# EAGLE design M5stack_proto2 (EAGLE 9.0.0)
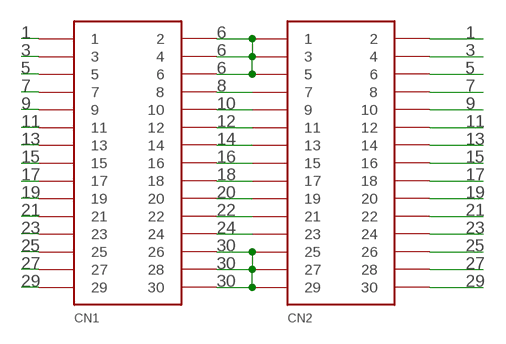
[diagram p0: schematic, sheet 1]

## Parts
CN1  CON_PINHD-2X15  [2X15SMD]
CN2  CON_PINHD-2X15  [2X15SMD]

## Nets
1: CN1.P$1 CN2.P$2
3: CN1.P$3 CN2.P$4
5: CN1.P$5 CN2.P$6
6: CN1.P$2 CN1.P$4 CN1.P$6 CN2.P$1 CN2.P$3 CN2.P$5
7: CN1.P$7 CN2.P$8
8: CN1.P$8 CN2.P$7
9: CN1.P$9 CN2.P$10
10: CN1.P$10 CN2.P$9
11: CN1.P$11 CN2.P$12
12: CN1.P$12 CN2.P$11
13: CN1.P$13 CN2.P$14
14: CN1.P$14 CN2.P$13
15: CN1.P$15 CN2.P$16
16: CN1.P$16 CN2.P$15
17: CN1.P$17 CN2.P$18
18: CN1.P$18 CN2.P$17
19: CN1.P$19 CN2.P$20
20: CN1.P$20 CN2.P$19
21: CN1.P$21 CN2.P$22
22: CN1.P$22 CN2.P$21
23: CN1.P$23 CN2.P$24
24: CN1.P$24 CN2.P$23
25: CN1.P$25 CN2.P$26
27: CN1.P$27 CN2.P$28
29: CN1.P$29 CN2.P$30
30: CN1.P$26 CN1.P$28 CN1.P$30 CN2.P$25 CN2.P$27 CN2.P$29

## Library data of the parts
CN1 CN2 = akita:CON_PINHD-2X15

## Board
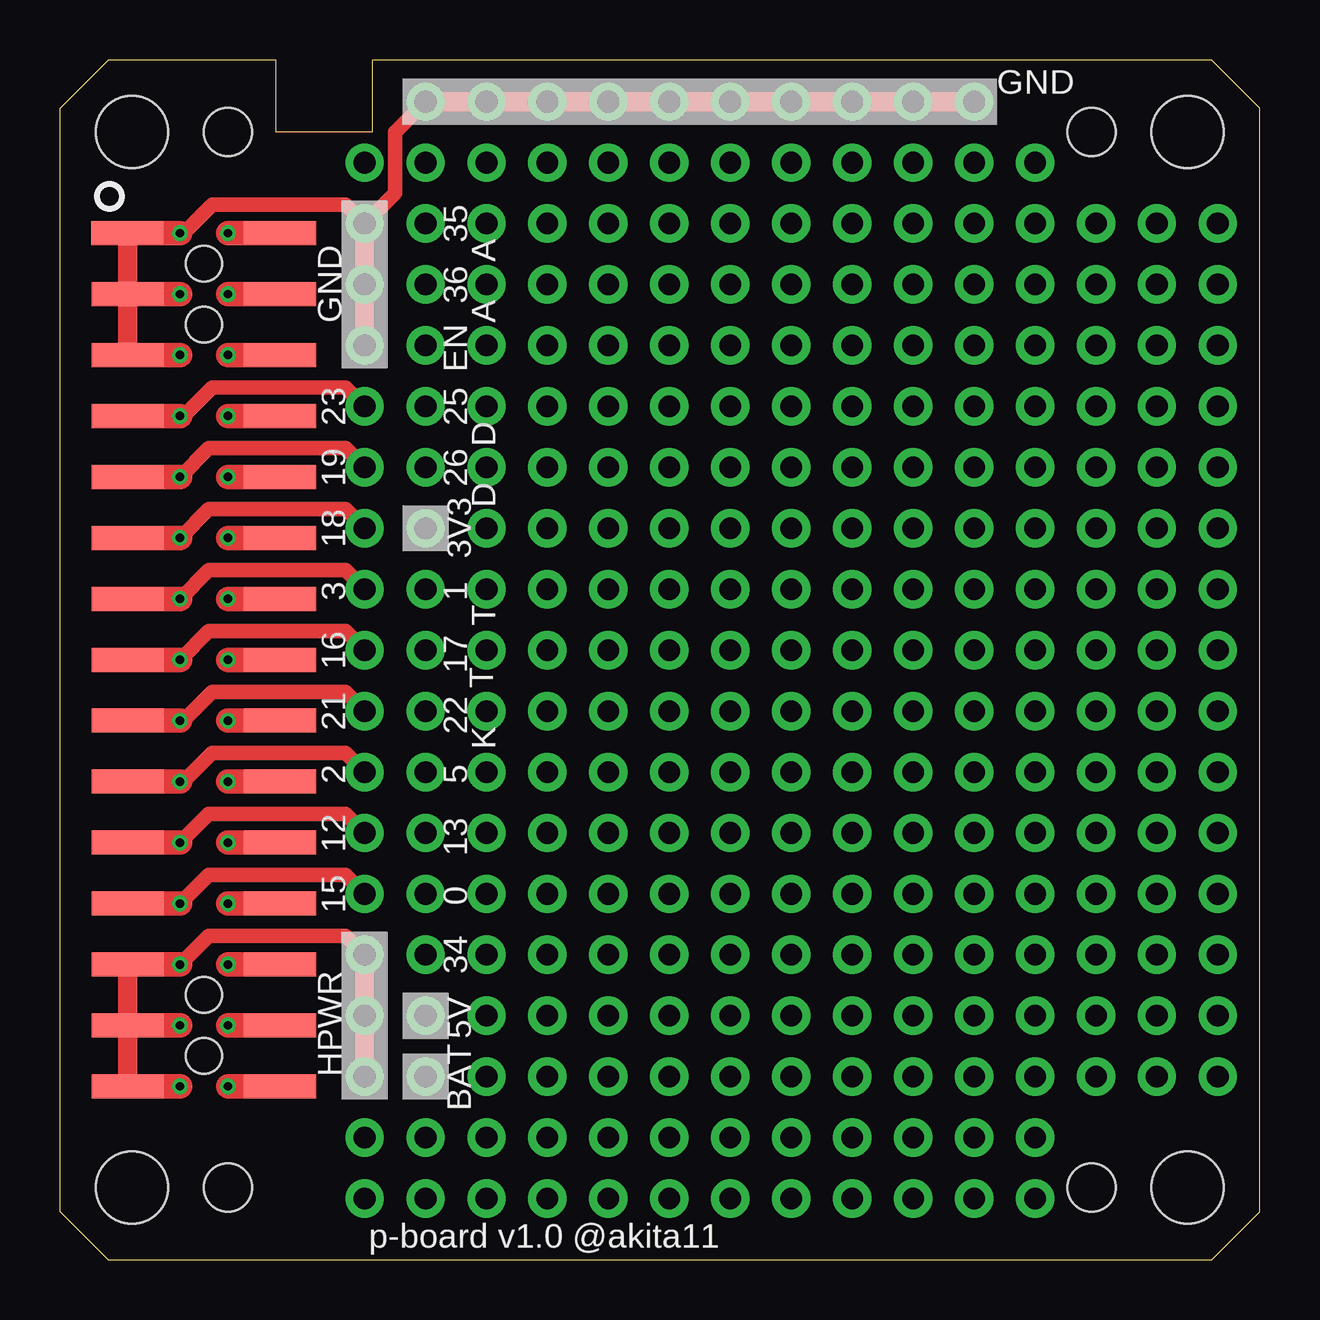
[diagram p1: board, top side]
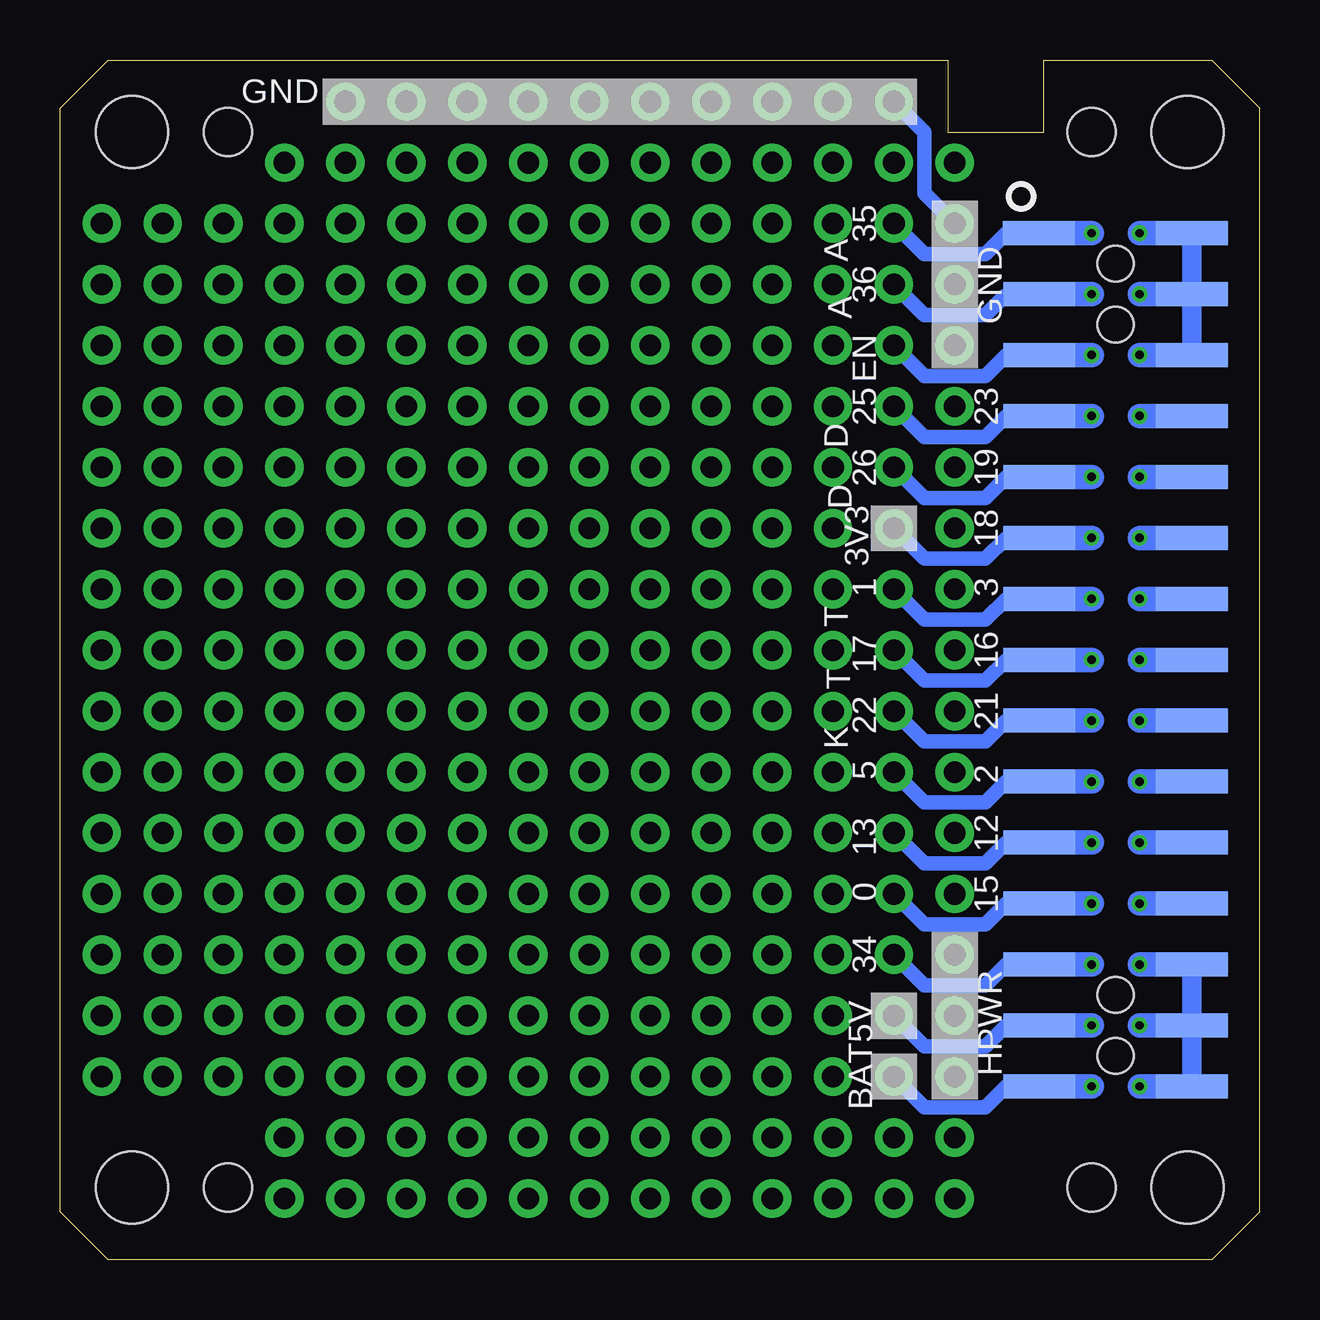
[diagram p2: board, bottom side, seen from below]

Size 50 x 50 mm. Coordinates in mm from the lower left corner, seen from the top.
Outline: 0,2 2,0 48,0 50,2 50,48 48,50 13,50 13,47 9,47 9,50 2,50 0,48 0,2
Copper layers (1*16): Top 0.035mm / dielectric 1.5mm / Bottom 0.035mm
Design rules "SeeedStudio_2layer_DRU_no_angle_20140221": minimum track width 6mil, minimum drill 12mil, track to track 6mil, track to pad 6mil, pad to pad 6mil, via to via 6mil, smd to smd 0mil, copper to edge 10mil, drill to drill 10mil, minimum pad ring 10mil, minimum via ring 6mil, stop-mask expansion 2mil, vias tented up to drill 100mil, thermal gap 10mil
Holes 3 mm at 3,3 3,47 47,47 47,3
Holes 2 mm at 7,3 7,47 43,47 43,3
Holes 1.5 mm at 6,41.51 6,38.97 6,8.49 6,11.03

### Footprints (pad centres in the part's own frame; a part is rotated, then mirrored left to right if it is on the bottom)
2X15SMD = smd 3 x 1: P$1 -3.2,17.78; P$2 3.175,17.78; P$3 -3.175,15.24; P$4 3.175,15.24; P$5 -3.175,12.7; P$6 3.175,12.7; P$7 -3.175,10.16; P$8 3.175,10.16; P$9 -3.175,7.62; P$10 3.175,7.62; P$11 -3.175,5.08; P$12 3.175,5.08; P$13 -3.175,2.54; P$14 3.175,2.54; P$15 -3.175,0; P$16 3.175,0; P$17 -3.175,-2.54; P$18 3.175,-2.54; P$19 -3.175,-5.08; P$20 3.175,-5.08; P$21 -3.175,-7.62; P$22 3.175,-7.62; P$23 -3.175,-10.16; P$24 3.175,-10.16; P$25 -3.175,-12.7; P$26 3.175,-12.7; P$27 -3.175,-15.24; P$28 3.175,-15.24; P$29 -3.175,-17.78; P$30 3.175,-17.78

### Placement (x,y rotation side)
CN1  6,25 0 bottom
CN2  6,25 0 top

### Tracks (layer width: path | path; a pad name or v marks a point on that pad's centre or on a via)
1  (via drill 0.35, 0.9 pad 1.6)
  Top 1.016: v7,42.78 CN2.P$2
  Bottom 0.61: CN1.P$1 10.56,42.78 11.43,41.91 13.97,41.91 v15.24,43.18
  Bottom 1.016: CN1.P$1 v7,42.78
3  (via drill 0.35, 0.9 pad 1.6)
  Top 1.016: CN2.P$4 v7,40.24
  Bottom 0.61: CN2.P$4 9.25,40.16 10.64,40.16 11.43,39.37 13.97,39.37 v15.24,40.64
  Bottom 1.016: v7,40.24 CN2.P$4
5  (via drill 0.35, 0.9 pad 1.6)
  Top 1.016: v7,37.7 CN2.P$6
  Bottom 0.61: v15.24,38.1 13.97,36.83 11.43,36.83 10.56,37.7 CN2.P$6
  Bottom 1.016: CN2.P$6 v7,37.7
6  (via drill 0.35, 0.9 pad 1.6)
  Top 0.61: v5,42.78 5.16,42.78 6.35,43.97 11.91,43.97 v12.7,43.18 13.97,44.45 13.97,46.99 v15.24,48.26
  Top 0.813: CN2.P$5 CN2.P$3 2.83,42.76 CN2.P$1 | v12.7,43.18 v12.7,40.64 v12.7,38.1 | v15.24,48.26 v17.78,48.26 v20.32,48.26 v22.86,48.26 v25.4,48.26 v27.94,48.26 v30.48,48.26 v33.02,48.26 v35.56,48.26 v38.1,48.26
  Top 1.016: CN2.P$5 v5,37.7 | CN2.P$1 v5,42.78 | v5,40.24 CN2.P$3
  Bottom 0.61: v12.7,43.18 13.97,44.45 13.97,46.99 v15.24,48.26
  Bottom 0.813: CN1.P$2 CN2.P$3 CN2.P$5
  Bottom 1.016: v5,37.7 CN2.P$5 | v5,42.78 CN1.P$2 | CN2.P$3 v5,40.24
7  (via drill 0.35, 0.9 pad 1.6)
  Top 1.016: CN2.P$8 v7,35.16
  Bottom 0.61: v15.24,35.56 13.97,34.29 11.43,34.29 10.56,35.16 CN2.P$8
  Bottom 1.016: v7,35.16 CN2.P$8
8  (via drill 0.35, 0.9 pad 1.6)
  Top 0.61: v5,35.16 5.16,35.16 6.35,36.35 11.91,36.35 v12.7,35.56
  Top 1.016: v5,35.16 CN2.P$7
  Bottom 1.016: CN2.P$7 v5,35.16
9  (via drill 0.35, 0.9 pad 1.6)
  Top 1.016: CN2.P$10 v7,32.62
  Bottom 0.61: v15.24,33.02 13.97,31.75 11.43,31.75 10.56,32.62 CN2.P$10
  Bottom 1.016: CN2.P$10 v7,32.62
10  (via drill 0.35, 0.9 pad 1.6)
  Top 0.61: v5,32.62 6.19,33.81 11.91,33.81 v12.7,33.02
  Top 1.016: CN2.P$9 v5,32.62
  Bottom 1.016: v5,32.62 CN2.P$9
11  (via drill 0.35, 0.9 pad 1.6)
  Top 1.016: CN2.P$12 v7,30.08
  Bottom 0.61: v15.24,30.48 13.97,29.21 11.43,29.21 10.56,30.08 CN2.P$12
  Bottom 1.016: v7,30.08 CN2.P$12
12  (via drill 0.35, 0.9 pad 1.6)
  Top 0.61: v5,30.08 6.19,31.27 11.91,31.27 v12.7,30.48
  Top 1.016: v5,30.08 CN2.P$11
  Bottom 1.016: CN2.P$11 v5,30.08
13  (via drill 0.35, 0.9 pad 1.6)
  Top 1.016: v7,27.54 CN2.P$14
  Bottom 0.61: v15.24,27.94 13.97,26.67 11.43,26.67 10.56,27.54 CN2.P$14
  Bottom 1.016: CN2.P$14 v7,27.54
14  (via drill 0.35, 0.9 pad 1.6)
  Top 0.61: v5,27.54 6.19,28.73 11.91,28.73 v12.7,27.94
  Top 1.016: CN2.P$13 v5,27.54
  Bottom 1.016: v5,27.54 CN2.P$13
15  (via drill 0.35, 0.9 pad 1.6)
  Top 1.016: CN2.P$16 v7,25
  Bottom 0.61: v15.24,25.4 13.97,24.13 11.43,24.13 10.56,25 CN2.P$16
  Bottom 1.016: v7,25 CN2.P$16
16  (via drill 0.35, 0.9 pad 1.6)
  Top 0.61: v5,25 6.19,26.19 10.16,26.19 10.95,26.19 11.91,26.19 v12.7,25.4
  Top 1.016: v5,25 CN2.P$15
  Bottom 1.016: CN2.P$15 v5,25
17  (via drill 0.35, 0.9 pad 1.6)
  Top 1.016: v7,22.46 CN2.P$18
  Bottom 0.61: v15.24,22.86 13.97,21.59 11.43,21.59 10.56,22.46 8.89,22.46
  Bottom 1.016: CN2.P$18 8.89,22.46 v7,22.46
18  (via drill 0.35, 0.9 pad 1.6)
  Top 0.61: v5,22.46 5.16,22.46 6.35,23.65 11.91,23.65 v12.7,22.86
  Top 1.016: CN2.P$17 v5,22.46
  Bottom 1.016: v5,22.46 CN2.P$17
19  (via drill 0.35, 0.9 pad 1.6)
  Top 1.016: CN2.P$20 v7,19.92
  Bottom 0.61: v15.24,20.32 13.97,19.05 11.43,19.05 10.56,19.92 CN2.P$20
  Bottom 1.016: v7,19.92 CN2.P$20
20  (via drill 0.35, 0.9 pad 1.6)
  Top 0.61: v5,19.92 5.16,19.92 6.35,21.11 11.91,21.11 v12.7,20.32
  Top 1.016: v5,19.92 CN2.P$19
  Bottom 1.016: CN2.P$19 v5,19.92
21  (via drill 0.35, 0.9 pad 1.6)
  Top 1.016: v7,17.38 CN2.P$22
  Bottom 0.61: v15.24,17.78 13.97,16.51 11.43,16.51 10.56,17.38 CN2.P$22
  Bottom 1.016: CN2.P$22 v7,17.38
22  (via drill 0.35, 0.9 pad 1.6)
  Top 0.61: v5,17.38 6.19,18.57 11.91,18.57 v12.7,17.78
  Top 1.016: CN2.P$21 v5,17.38
  Bottom 1.016: v5,17.38 CN2.P$21
23  (via drill 0.35, 0.9 pad 1.6)
  Top 1.016: CN2.P$24 v7,14.84
  Bottom 0.61: v15.24,15.24 13.97,13.97 11.43,13.97 10.56,14.84 CN2.P$24
  Bottom 1.016: v7,14.84 CN2.P$24
24  (via drill 0.35, 0.9 pad 1.6)
  Top 0.61: v5,14.84 6.19,16.03 11.91,16.03 v12.7,15.24
  Top 1.016: v5,14.84 CN2.P$23
  Bottom 1.016: CN2.P$23 v5,14.84
25  (via drill 0.35, 0.9 pad 1.6)
  Top 1.016: v7,12.3 CN2.P$26
  Bottom 0.61: v15.24,12.7 13.97,11.43 11.43,11.43 10.56,12.3 CN2.P$26
  Bottom 1.016: CN2.P$26 v7,12.3
27  (via drill 0.35, 0.9 pad 1.6)
  Top 1.016: CN2.P$28 v7,9.76
  Bottom 0.61: v15.24,10.16 13.97,8.89 11.43,8.89 10.56,9.76 CN2.P$28
  Bottom 1.016: v7,9.76 CN2.P$28
29  (via drill 0.35, 0.9 pad 1.6)
  Top 1.016: v7,7.22 CN2.P$30
  Bottom 0.61: v15.24,7.62 13.97,6.35 11.43,6.35 10.56,7.22 CN2.P$30
  Bottom 1.016: CN2.P$30 v7,7.22
30  (via drill 0.35, 0.9 pad 1.6)
  Top 0.61: v5,12.3 6.19,13.49 11.91,13.49 v12.7,12.7
  Top 0.813: CN2.P$25 CN2.P$27 CN2.P$29 | v12.7,12.7 v12.7,10.16 v12.7,7.62
  Top 1.016: CN2.P$29 v5,7.22 | CN2.P$25 v5,12.3 | v5,9.76 CN2.P$27
  Bottom 0.813: CN2.P$29 CN2.P$27 CN2.P$25
  Bottom 1.016: v5,7.22 CN2.P$29 | v5,12.3 CN2.P$25 | CN2.P$27 v5,9.76
N$2  (via drill 0.9 pad 1.6)
  other vias: 12.7,45.72
N$18  (via drill 0.9 pad 1.6)
  other vias: 12.7,5.08
N$19  (via drill 0.9 pad 1.6)
  other vias: 12.7,2.54
N$21  (via drill 0.9 pad 1.6)
  other vias: 15.24,45.72
N$37  (via drill 0.9 pad 1.6)
  other vias: 15.24,5.08
N$38  (via drill 0.9 pad 1.6)
  other vias: 15.24,2.54
N$40  (via drill 0.9 pad 1.6)
  other vias: 17.78,45.72
N$41  (via drill 0.9 pad 1.6)
  other vias: 17.78,43.18
N$42  (via drill 0.9 pad 1.6)
  other vias: 17.78,40.64
N$43  (via drill 0.9 pad 1.6)
  other vias: 17.78,38.1
N$44  (via drill 0.9 pad 1.6)
  other vias: 17.78,35.56
N$45  (via drill 0.9 pad 1.6)
  other vias: 17.78,33.02
N$46  (via drill 0.9 pad 1.6)
  other vias: 17.78,30.48
N$47  (via drill 0.9 pad 1.6)
  other vias: 17.78,27.94
N$48  (via drill 0.9 pad 1.6)
  other vias: 17.78,25.4
N$49  (via drill 0.9 pad 1.6)
  other vias: 17.78,22.86
N$50  (via drill 0.9 pad 1.6)
  other vias: 17.78,20.32
N$51  (via drill 0.9 pad 1.6)
  other vias: 17.78,17.78
N$52  (via drill 0.9 pad 1.6)
  other vias: 17.78,15.24
N$53  (via drill 0.9 pad 1.6)
  other vias: 17.78,12.7
N$54  (via drill 0.9 pad 1.6)
  other vias: 17.78,10.16
N$55  (via drill 0.9 pad 1.6)
  other vias: 17.78,7.62
N$56  (via drill 0.9 pad 1.6)
  other vias: 17.78,5.08
N$57  (via drill 0.9 pad 1.6)
  other vias: 17.78,2.54
N$59  (via drill 0.9 pad 1.6)
  other vias: 20.32,45.72
N$60  (via drill 0.9 pad 1.6)
  other vias: 20.32,43.18
N$61  (via drill 0.9 pad 1.6)
  other vias: 20.32,40.64
N$62  (via drill 0.9 pad 1.6)
  other vias: 20.32,38.1
N$63  (via drill 0.9 pad 1.6)
  other vias: 20.32,35.56
N$64  (via drill 0.9 pad 1.6)
  other vias: 20.32,33.02
N$65  (via drill 0.9 pad 1.6)
  other vias: 20.32,30.48
N$66  (via drill 0.9 pad 1.6)
  other vias: 20.32,27.94
N$67  (via drill 0.9 pad 1.6)
  other vias: 20.32,25.4
N$68  (via drill 0.9 pad 1.6)
  other vias: 20.32,22.86
N$69  (via drill 0.9 pad 1.6)
  other vias: 20.32,20.32
N$70  (via drill 0.9 pad 1.6)
  other vias: 20.32,17.78
N$71  (via drill 0.9 pad 1.6)
  other vias: 20.32,15.24
N$72  (via drill 0.9 pad 1.6)
  other vias: 20.32,12.7
N$73  (via drill 0.9 pad 1.6)
  other vias: 20.32,10.16
N$74  (via drill 0.9 pad 1.6)
  other vias: 20.32,7.62
N$75  (via drill 0.9 pad 1.6)
  other vias: 20.32,5.08
N$76  (via drill 0.9 pad 1.6)
  other vias: 20.32,2.54
N$78  (via drill 0.9 pad 1.6)
  other vias: 22.86,45.72
N$79  (via drill 0.9 pad 1.6)
  other vias: 22.86,43.18
N$80  (via drill 0.9 pad 1.6)
  other vias: 22.86,40.64
N$81  (via drill 0.9 pad 1.6)
  other vias: 22.86,38.1
N$82  (via drill 0.9 pad 1.6)
  other vias: 22.86,35.56
N$83  (via drill 0.9 pad 1.6)
  other vias: 22.86,33.02
N$84  (via drill 0.9 pad 1.6)
  other vias: 22.86,30.48
N$85  (via drill 0.9 pad 1.6)
  other vias: 22.86,27.94
N$86  (via drill 0.9 pad 1.6)
  other vias: 22.86,25.4
N$87  (via drill 0.9 pad 1.6)
  other vias: 22.86,22.86
N$88  (via drill 0.9 pad 1.6)
  other vias: 22.86,20.32
N$89  (via drill 0.9 pad 1.6)
  other vias: 22.86,17.78
N$90  (via drill 0.9 pad 1.6)
  other vias: 22.86,15.24
N$91  (via drill 0.9 pad 1.6)
  other vias: 22.86,12.7
N$92  (via drill 0.9 pad 1.6)
  other vias: 22.86,10.16
N$93  (via drill 0.9 pad 1.6)
  other vias: 22.86,7.62
N$94  (via drill 0.9 pad 1.6)
  other vias: 22.86,5.08
N$95  (via drill 0.9 pad 1.6)
  other vias: 22.86,2.54
N$97  (via drill 0.9 pad 1.6)
  other vias: 25.4,45.72
N$98  (via drill 0.9 pad 1.6)
  other vias: 25.4,43.18
N$99  (via drill 0.9 pad 1.6)
  other vias: 25.4,40.64
N$100  (via drill 0.9 pad 1.6)
  other vias: 25.4,38.1
N$101  (via drill 0.9 pad 1.6)
  other vias: 25.4,35.56
N$102  (via drill 0.9 pad 1.6)
  other vias: 25.4,33.02
N$103  (via drill 0.9 pad 1.6)
  other vias: 25.4,30.48
N$104  (via drill 0.9 pad 1.6)
  other vias: 25.4,27.94
N$105  (via drill 0.9 pad 1.6)
  other vias: 25.4,25.4
N$106  (via drill 0.9 pad 1.6)
  other vias: 25.4,22.86
N$107  (via drill 0.9 pad 1.6)
  other vias: 25.4,20.32
N$108  (via drill 0.9 pad 1.6)
  other vias: 25.4,17.78
N$109  (via drill 0.9 pad 1.6)
  other vias: 25.4,15.24
N$110  (via drill 0.9 pad 1.6)
  other vias: 25.4,12.7
N$111  (via drill 0.9 pad 1.6)
  other vias: 25.4,10.16
N$112  (via drill 0.9 pad 1.6)
  other vias: 25.4,7.62
N$113  (via drill 0.9 pad 1.6)
  other vias: 25.4,5.08
N$114  (via drill 0.9 pad 1.6)
  other vias: 25.4,2.54
N$116  (via drill 0.9 pad 1.6)
  other vias: 27.94,45.72
N$117  (via drill 0.9 pad 1.6)
  other vias: 27.94,43.18
N$118  (via drill 0.9 pad 1.6)
  other vias: 27.94,40.64
N$119  (via drill 0.9 pad 1.6)
  other vias: 27.94,38.1
N$120  (via drill 0.9 pad 1.6)
  other vias: 27.94,35.56
N$121  (via drill 0.9 pad 1.6)
  other vias: 27.94,33.02
N$122  (via drill 0.9 pad 1.6)
  other vias: 27.94,30.48
N$123  (via drill 0.9 pad 1.6)
  other vias: 27.94,27.94
N$124  (via drill 0.9 pad 1.6)
  other vias: 27.94,25.4
N$125  (via drill 0.9 pad 1.6)
  other vias: 27.94,22.86
N$126  (via drill 0.9 pad 1.6)
  other vias: 27.94,20.32
N$127  (via drill 0.9 pad 1.6)
  other vias: 27.94,17.78
N$128  (via drill 0.9 pad 1.6)
  other vias: 27.94,15.24
N$129  (via drill 0.9 pad 1.6)
  other vias: 27.94,12.7
N$130  (via drill 0.9 pad 1.6)
  other vias: 27.94,10.16
N$131  (via drill 0.9 pad 1.6)
  other vias: 27.94,7.62
N$132  (via drill 0.9 pad 1.6)
  other vias: 27.94,5.08
N$133  (via drill 0.9 pad 1.6)
  other vias: 27.94,2.54
N$135  (via drill 0.9 pad 1.6)
  other vias: 30.48,45.72
N$136  (via drill 0.9 pad 1.6)
  other vias: 30.48,43.18
N$137  (via drill 0.9 pad 1.6)
  other vias: 30.48,40.64
N$138  (via drill 0.9 pad 1.6)
  other vias: 30.48,38.1
N$139  (via drill 0.9 pad 1.6)
  other vias: 30.48,35.56
N$140  (via drill 0.9 pad 1.6)
  other vias: 30.48,33.02
N$141  (via drill 0.9 pad 1.6)
  other vias: 30.48,30.48
N$142  (via drill 0.9 pad 1.6)
  other vias: 30.48,27.94
N$143  (via drill 0.9 pad 1.6)
  other vias: 30.48,25.4
N$144  (via drill 0.9 pad 1.6)
  other vias: 30.48,22.86
N$145  (via drill 0.9 pad 1.6)
  other vias: 30.48,20.32
N$146  (via drill 0.9 pad 1.6)
  other vias: 30.48,17.78
N$147  (via drill 0.9 pad 1.6)
  other vias: 30.48,15.24
N$148  (via drill 0.9 pad 1.6)
  other vias: 30.48,12.7
N$149  (via drill 0.9 pad 1.6)
  other vias: 30.48,10.16
N$150  (via drill 0.9 pad 1.6)
  other vias: 30.48,7.62
N$151  (via drill 0.9 pad 1.6)
  other vias: 30.48,5.08
N$152  (via drill 0.9 pad 1.6)
  other vias: 30.48,2.54
N$154  (via drill 0.9 pad 1.6)
  other vias: 33.02,45.72
N$155  (via drill 0.9 pad 1.6)
  other vias: 33.02,43.18
N$156  (via drill 0.9 pad 1.6)
  other vias: 33.02,40.64
N$157  (via drill 0.9 pad 1.6)
  other vias: 33.02,38.1
N$158  (via drill 0.9 pad 1.6)
  other vias: 33.02,35.56
N$159  (via drill 0.9 pad 1.6)
  other vias: 33.02,33.02
N$160  (via drill 0.9 pad 1.6)
  other vias: 33.02,30.48
N$161  (via drill 0.9 pad 1.6)
  other vias: 33.02,27.94
N$162  (via drill 0.9 pad 1.6)
  other vias: 33.02,25.4
N$163  (via drill 0.9 pad 1.6)
  other vias: 33.02,22.86
N$164  (via drill 0.9 pad 1.6)
  other vias: 33.02,20.32
N$165  (via drill 0.9 pad 1.6)
  other vias: 33.02,17.78
N$166  (via drill 0.9 pad 1.6)
  other vias: 33.02,15.24
N$167  (via drill 0.9 pad 1.6)
  other vias: 33.02,12.7
N$168  (via drill 0.9 pad 1.6)
  other vias: 33.02,10.16
N$169  (via drill 0.9 pad 1.6)
  other vias: 33.02,7.62
N$170  (via drill 0.9 pad 1.6)
  other vias: 33.02,5.08
N$171  (via drill 0.9 pad 1.6)
  other vias: 33.02,2.54
N$173  (via drill 0.9 pad 1.6)
  other vias: 35.56,45.72
N$174  (via drill 0.9 pad 1.6)
  other vias: 35.56,43.18
N$175  (via drill 0.9 pad 1.6)
  other vias: 35.56,40.64
N$176  (via drill 0.9 pad 1.6)
  other vias: 35.56,38.1
N$177  (via drill 0.9 pad 1.6)
  other vias: 35.56,35.56
N$178  (via drill 0.9 pad 1.6)
  other vias: 35.56,33.02
N$179  (via drill 0.9 pad 1.6)
  other vias: 35.56,30.48
N$180  (via drill 0.9 pad 1.6)
  other vias: 35.56,27.94
N$181  (via drill 0.9 pad 1.6)
  other vias: 35.56,25.4
N$182  (via drill 0.9 pad 1.6)
  other vias: 35.56,22.86
N$183  (via drill 0.9 pad 1.6)
  other vias: 35.56,20.32
N$184  (via drill 0.9 pad 1.6)
  other vias: 35.56,17.78
N$185  (via drill 0.9 pad 1.6)
  other vias: 35.56,15.24
N$186  (via drill 0.9 pad 1.6)
  other vias: 35.56,12.7
N$187  (via drill 0.9 pad 1.6)
  other vias: 35.56,10.16
N$188  (via drill 0.9 pad 1.6)
  other vias: 35.56,7.62
N$189  (via drill 0.9 pad 1.6)
  other vias: 35.56,5.08
N$190  (via drill 0.9 pad 1.6)
  other vias: 35.56,2.54
N$192  (via drill 0.9 pad 1.6)
  other vias: 38.1,45.72
N$193  (via drill 0.9 pad 1.6)
  other vias: 38.1,43.18
N$194  (via drill 0.9 pad 1.6)
  other vias: 38.1,40.64
N$195  (via drill 0.9 pad 1.6)
  other vias: 38.1,38.1
N$196  (via drill 0.9 pad 1.6)
  other vias: 38.1,35.56
N$197  (via drill 0.9 pad 1.6)
  other vias: 38.1,33.02
N$198  (via drill 0.9 pad 1.6)
  other vias: 38.1,30.48
N$199  (via drill 0.9 pad 1.6)
  other vias: 38.1,27.94
N$200  (via drill 0.9 pad 1.6)
  other vias: 38.1,25.4
N$201  (via drill 0.9 pad 1.6)
  other vias: 38.1,22.86
N$202  (via drill 0.9 pad 1.6)
  other vias: 38.1,20.32
N$203  (via drill 0.9 pad 1.6)
  other vias: 38.1,17.78
N$204  (via drill 0.9 pad 1.6)
  other vias: 38.1,15.24
N$205  (via drill 0.9 pad 1.6)
  other vias: 38.1,12.7
N$206  (via drill 0.9 pad 1.6)
  other vias: 38.1,10.16
N$207  (via drill 0.9 pad 1.6)
  other vias: 38.1,7.62
N$208  (via drill 0.9 pad 1.6)
  other vias: 38.1,5.08
N$209  (via drill 0.9 pad 1.6)
  other vias: 38.1,2.54
N$211  (via drill 0.9 pad 1.6)
  other vias: 40.64,45.72
N$212  (via drill 0.9 pad 1.6)
  other vias: 40.64,43.18
N$213  (via drill 0.9 pad 1.6)
  other vias: 40.64,40.64
N$214  (via drill 0.9 pad 1.6)
  other vias: 40.64,38.1
N$215  (via drill 0.9 pad 1.6)
  other vias: 40.64,35.56
N$216  (via drill 0.9 pad 1.6)
  other vias: 40.64,33.02
N$217  (via drill 0.9 pad 1.6)
  other vias: 40.64,30.48
N$218  (via drill 0.9 pad 1.6)
  other vias: 40.64,27.94
N$219  (via drill 0.9 pad 1.6)
  other vias: 40.64,25.4
N$220  (via drill 0.9 pad 1.6)
  other vias: 40.64,22.86
N$221  (via drill 0.9 pad 1.6)
  other vias: 40.64,20.32
N$222  (via drill 0.9 pad 1.6)
  other vias: 40.64,17.78
N$223  (via drill 0.9 pad 1.6)
  other vias: 40.64,15.24
N$224  (via drill 0.9 pad 1.6)
  other vias: 40.64,12.7
N$225  (via drill 0.9 pad 1.6)
  other vias: 40.64,10.16
N$226  (via drill 0.9 pad 1.6)
  other vias: 40.64,7.62
N$227  (via drill 0.9 pad 1.6)
  other vias: 40.64,5.08
N$228  (via drill 0.9 pad 1.6)
  other vias: 40.64,2.54
N$231  (via drill 0.9 pad 1.6)
  other vias: 43.18,43.18
N$232  (via drill 0.9 pad 1.6)
  other vias: 43.18,40.64
N$233  (via drill 0.9 pad 1.6)
  other vias: 43.18,38.1
N$234  (via drill 0.9 pad 1.6)
  other vias: 43.18,35.56
N$235  (via drill 0.9 pad 1.6)
  other vias: 43.18,33.02
N$236  (via drill 0.9 pad 1.6)
  other vias: 43.18,30.48
N$237  (via drill 0.9 pad 1.6)
  other vias: 43.18,27.94
N$238  (via drill 0.9 pad 1.6)
  other vias: 43.18,25.4
N$239  (via drill 0.9 pad 1.6)
  other vias: 43.18,22.86
N$240  (via drill 0.9 pad 1.6)
  other vias: 43.18,20.32
N$241  (via drill 0.9 pad 1.6)
  other vias: 43.18,17.78
N$242  (via drill 0.9 pad 1.6)
  other vias: 43.18,15.24
N$243  (via drill 0.9 pad 1.6)
  other vias: 43.18,12.7
N$244  (via drill 0.9 pad 1.6)
  other vias: 43.18,10.16
N$245  (via drill 0.9 pad 1.6)
  other vias: 43.18,7.62
N$250  (via drill 0.9 pad 1.6)
  other vias: 45.72,43.18
N$251  (via drill 0.9 pad 1.6)
  other vias: 45.72,40.64
N$252  (via drill 0.9 pad 1.6)
  other vias: 45.72,38.1
N$253  (via drill 0.9 pad 1.6)
  other vias: 45.72,35.56
N$254  (via drill 0.9 pad 1.6)
  other vias: 45.72,33.02
N$255  (via drill 0.9 pad 1.6)
  other vias: 45.72,30.48
N$256  (via drill 0.9 pad 1.6)
  other vias: 45.72,27.94
N$257  (via drill 0.9 pad 1.6)
  other vias: 45.72,25.4
N$258  (via drill 0.9 pad 1.6)
  other vias: 45.72,22.86
N$259  (via drill 0.9 pad 1.6)
  other vias: 45.72,20.32
N$260  (via drill 0.9 pad 1.6)
  other vias: 45.72,17.78
N$261  (via drill 0.9 pad 1.6)
  other vias: 45.72,15.24
N$262  (via drill 0.9 pad 1.6)
  other vias: 45.72,12.7
N$263  (via drill 0.9 pad 1.6)
  other vias: 45.72,10.16
N$264  (via drill 0.9 pad 1.6)
  other vias: 45.72,7.62
N$269  (via drill 0.9 pad 1.6)
  other vias: 48.26,43.18
N$270  (via drill 0.9 pad 1.6)
  other vias: 48.26,40.64
N$271  (via drill 0.9 pad 1.6)
  other vias: 48.26,38.1
N$272  (via drill 0.9 pad 1.6)
  other vias: 48.26,35.56
N$273  (via drill 0.9 pad 1.6)
  other vias: 48.26,33.02
N$274  (via drill 0.9 pad 1.6)
  other vias: 48.26,30.48
N$275  (via drill 0.9 pad 1.6)
  other vias: 48.26,27.94
N$276  (via drill 0.9 pad 1.6)
  other vias: 48.26,25.4
N$277  (via drill 0.9 pad 1.6)
  other vias: 48.26,22.86
N$278  (via drill 0.9 pad 1.6)
  other vias: 48.26,20.32
N$279  (via drill 0.9 pad 1.6)
  other vias: 48.26,17.78
N$280  (via drill 0.9 pad 1.6)
  other vias: 48.26,15.24
N$281  (via drill 0.9 pad 1.6)
  other vias: 48.26,12.7
N$282  (via drill 0.9 pad 1.6)
  other vias: 48.26,10.16
N$283  (via drill 0.9 pad 1.6)
  other vias: 48.26,7.62

### Text on the board
tPlace: GND | A | 35 | 36 | A | GND | EN | 23 | 25 | D | 19 | 26 | D | 18 | 3V3 | 3 | 1 | T | 16 | T | 17 | 21 | 22 | K | 2 | 5 | 12 | 13 | 0 | 15 | 34 | 5V | HPWR | BAT | p-board v1.0 @akita11
bPlace: GND | 35 | GND | A | 36 | A | EN | 23 | 25 | 19 | 26 | D | 18 | D | 3V3 | 3 | 1 | 16 | 17 | T | 21 | T | 22 | 2 | 5 | K | 12 | 13 | 15 | 0 | 34 | HPWR | 5V | BAT